# Altium schematic sheet DCDC_Slow.SchDoc
size 594 x 420 mm; Address1: Address1; Address2: Address2; Address3: Address3; Address4: Address4; SheetNumber: 1; Scale: 1:1; Разраб.: Иванов; Обозначение документа: АБВГ.123456.001 Э3; Пров.: Петров; Утв.: Сидоров; Наименование организации: ОАО "Концерн "МПО-Гидроприбор"; Перв. применение: АБВГ.123456.000; Наименование изделия 1: Плата; Наименование изделия 2: Схема электрическая; Наименование изделия 3: принципиальная; Нач. отд.: Нач. отд.; Фамилия нач. отд.: Сидоров
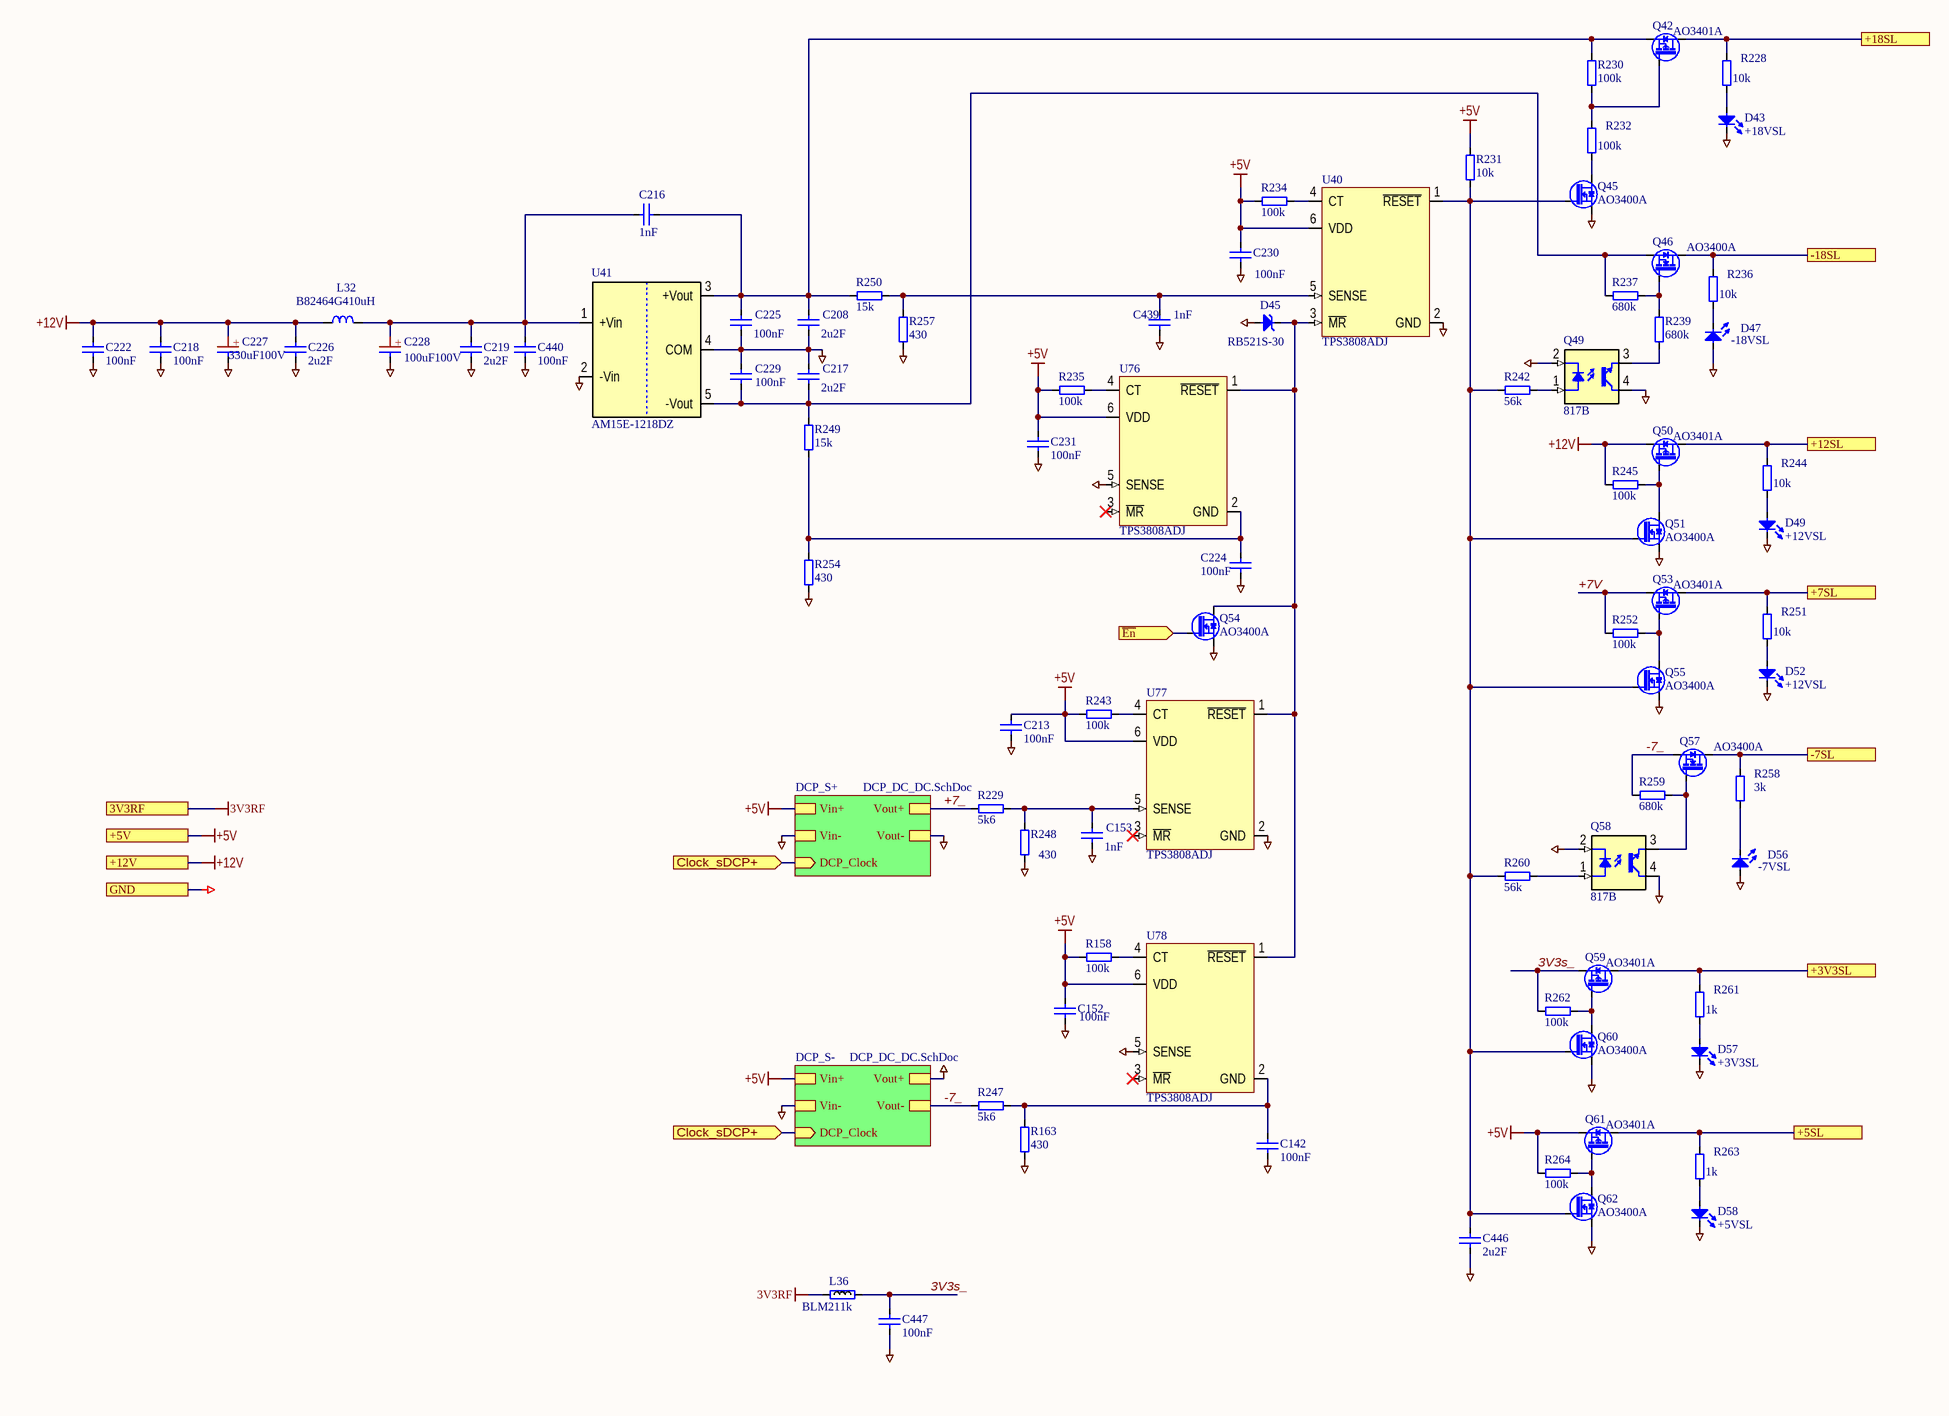
[diagram p0: DCDC_Slow.SchDoc]

## Parts
C142  100nF  [SMD0805CAP]
C152  100nF  [SMD0805CAP]
C153  1nF  [SMD0805CAP]
C208  2u2F  [SMD0805CAP]
C213  100nF  [SMD0805CAP]
C216  1nF  [SMD0805CAP]
C217  2u2F  [SMD0805CAP]
C218  100nF  [SMD0805CAP]
C219  2u2F  [SMD0805CAP]
C222  100nF  [SMD0805CAP]
C224  100nF  [SMD0805CAP]
C225  100nF  [SMD0805CAP]
C226  2u2F  [SMD0805CAP]
C227  330uF100V  [CAPPR750-1600X2000]
C228  100uF100V  [CAPPR500-1000X1250]
C229  100nF  [SMD0805CAP]
C230  100nF  [SMD0805CAP]
C231  100nF  [SMD0805CAP]
C439  1nF  [SMD0805CAP]
C440  100nF  [SMD0805CAP]
C446  2u2F  [SMD0805CAP]
C447  100nF  [SMD0805CAP]
D43  +18VSL  [LED0603]
D45  RB521S-30  [SODFL1608X65N]
D47  -18VSL  [LED0603]
D49  +12VSL  [LED0603]
D52  +12VSL  [LED0603]
D56  -7VSL  [LED0603]
D57  +3V3SL  [LED0603]
D58  +5VSL  [LED0603]
L32  B82464G410uH  [IND_COILCRAFT_MSS1038]
L36  BLM211k  [RESC2012X50N]
Q42  AO3401A  [SOT95P229X119-3N]
Q45  AO3400A  [SOT95P229X119-3N]
Q46  AO3400A  [SOT95P229X119-3N]
Q49  817B  [DIP4-300]
Q50  AO3401A  [SOT95P229X119-3N]
Q51  AO3400A  [SOT95P229X119-3N]
Q53  AO3401A  [SOT95P229X119-3N]
Q54  AO3400A  [SOT95P229X119-3N]
Q55  AO3400A  [SOT95P229X119-3N]
Q57  AO3400A  [SOT95P229X119-3N]
Q58  817B  [DIP4-300]
Q59  AO3401A  [SOT95P229X119-3N]
Q60  AO3400A  [SOT95P229X119-3N]
Q61  AO3401A  [SOT95P229X119-3N]
Q62  AO3400A  [SOT95P229X119-3N]
R158  100k  [SMD0805RES]
R163  430  [SMD0805RES]
R228  10k  [SMD0805RES]
R229  5k6  [SMD0805RES]
R230  100k  [SMD0805RES]
R231  10k  [SMD0805RES]
R232  100k  [SMD0805RES]
R234  100k  [SMD0805RES]
R235  100k  [SMD0805RES]
R236  10k  [SMD0805RES]
R237  680k  [SMD0805RES]
R239  680k  [SMD0805RES]
R242  56k  [SMD0805RES]
R243  100k  [SMD0805RES]
R244  10k  [SMD0805RES]
R245  100k  [SMD0805RES]
R247  5k6  [SMD0805RES]
R248  430  [SMD0805RES]
R249  15k  [SMD0805RES]
R250  15k  [SMD0805RES]
R251  10k  [SMD0805RES]
R252  100k  [SMD0805RES]
R254  430  [SMD0805RES]
R257  430  [SMD0805RES]
R258  3k  [SMD0805RES]
R259  680k  [SMD0805RES]
R260  56k  [SMD0805RES]
R261  1k  [SMD0805RES]
R262  100k  [SMD0805RES]
R263  1k  [SMD0805RES]
R264  100k  [SMD0805RES]
U40  TPS3808ADJ  [SOT95P270X145-6N]
U41  AM15E-1218DZ  [AM15E]
U76  TPS3808ADJ  [SOT95P270X145-6N]
U77  TPS3808ADJ  [SOT95P270X145-6N]
U78  TPS3808ADJ  [SOT95P270X145-6N]

## Sub-sheets
DCP_S+ = DCP_DC_DC.SchDoc: DCP_Clock (in), Vout+, Vout-, Vin-, Vin+
DCP_S- = DCP_DC_DC.SchDoc: DCP_Clock (in), Vout+, Vout-, Vin-, Vin+

## Ports
3V3RF, +3V3SL, +5SL, +5V, +7SL, +12SL, +12V, +18SL, -7SL, -18SL, Clock_sDCP+ (in), GND, ~{En} (in)

## Nets
3V3RF: L36.2 ; port 3V3RF
+5V: C152.2 C213.2 C230.2 C231.2 Q61.2(S) R158.1 R231.1 R234.1 R235.1 R243.1 R264.2 U40.6(VDD) U76.6(VDD) U77.6(VDD) U78.6(VDD) ; port +5V, sheet DCP_S+/Vin+, sheet DCP_S-/Vin+
+12V: C218.2 C222.2 C226.2 C227.1(+) L32.1 Q50.2(S) R245.2 ; port +12V
GND: C142.2 C152.1 C153.1 C208.1 C213.1 C217.2 C218.1 C219.1 C222.1 C224.2 C225.2 C226.1 C227.2 C228.2 C229.1 C230.1 C231.1 C439.1 C440.2 C446.2 C447.1 D43.1(C) D45.2(A) D47.2(A) D49.1(C) D52.1(C) D56.2(A) D57.1(C) D58.1(C) Q45.2(S) Q49.2(C) Q49.4(C) Q51.2(S) Q54.2(S) Q55.2(S) Q58.2(C) Q58.4(C) Q60.2(S) Q62.2(S) R163.1 R248.2 R254.1 R257.1 U40.2(GND) U41.2(-Vin) U41.4(COM) U76.5(SENSE) U77.2(GND) U78.5(SENSE) ; port GND, sheet DCP_S+/Vout-, sheet DCP_S+/Vin-, sheet DCP_S-/Vout+, sheet DCP_S-/Vin-
3V3s_: C447.2 L36.1 Q59.2(S) R262.2
+3V3SL: Q59.3(D) R261.2 ; port +3V3SL
+5SL: Q61.3(D) R263.2 ; port +5SL
+7_: R229.2 ; sheet DCP_S+/Vout+
+7SL: Q53.3(D) R251.2 ; port +7SL
+7V: Q53.2(S) R252.2
+12SL: Q50.3(D) R244.2 ; port +12SL
+18SL: Q42.3(D) R228.2 ; port +18SL
-7_: Q57.2(S) R247.1 R259.2 ; sheet DCP_S-/Vout-
-7SL: Q57.3(D) R258.2 ; port -7SL
-18SL: Q46.3(D) R236.2 ; port -18SL
~{En}: Q54.1(G) ; port ~{En}
Clock_sDCP+: port Clock_sDCP+, sheet DCP_S+/DCP_Clock, sheet DCP_S-/DCP_Clock
NetC142_1: C142.1 R163.2 R247.2 U78.2(GND)
NetC153_2: C153.2 R229.1 R248.1 U77.5(SENSE)
NetC208_2: C208.2 C216.2 C225.1 Q42.2(S) R230.1 R250.2 U41.3(+Vout)
NetC216_1: C216.1 C219.2 C228.1(+) C440.1 L32.2 U41.1(+Vin)
NetC217_1: C217.1 C229.2 Q46.2(S) R237.2 R249.1 U41.5(-Vout)
NetC224_1: C224.1 R249.2 R254.2 U76.2(GND)
NetC439_2: C439.2 R250.1 R257.2 U40.5(SENSE)
NetC446_1: C446.1 Q45.1(G) Q51.1(G) Q55.1(G) Q60.1(G) Q62.1(G) R231.2 R242.1 R260.1 U40.1(~{RESET})
NetD43_2: D43.2(A) R228.1
NetD45_1: D45.1(C) Q54.3(D) U40.3(~{MR}) U76.1(~{RESET}) U77.1(~{RESET}) U78.1(~{RESET})
NetD47_1: D47.1(C) R236.1
NetD49_2: D49.2(A) R244.1
NetD52_2: D52.2(A) R251.1
NetD56_1: D56.1(C) R258.1
NetD57_2: D57.2(A) R261.1
NetD58_2: D58.2(A) R263.1
NetQ42_1: Q42.1(G) R230.2 R232.2
NetQ45_3: Q45.3(D) R232.1
NetQ46_1: Q46.1(G) R237.1 R239.2
NetQ49_1: Q49.1(A) R242.2
NetQ49_3: Q49.3(E) R239.1
NetQ50_1: Q50.1(G) Q51.3(D) R245.1
NetQ53_1: Q53.1(G) Q55.3(D) R252.1
NetQ57_1: Q57.1(G) Q58.3(E) R259.1
NetQ58_1: Q58.1(A) R260.2
NetQ59_1: Q59.1(G) Q60.3(D) R262.1
NetQ61_1: Q61.1(G) Q62.3(D) R264.1
NetR158_2: R158.2 U78.4(CT)
NetR234_2: R234.2 U40.4(CT)
NetR235_2: R235.2 U76.4(CT)
NetR243_2: R243.2 U77.4(CT)

Not connected (* = marked no-connect by the designer): U76 3(~{MR})*; U77 3(~{MR})*; U78 3(~{MR})*

## Notes on the sheet
- Подп. и дата
- Инв. № дубл.
- Взам. инв. №
- Инв. № подл.
- Изм.
- Лист
- № докум.
- Подп.
- Дата
- Копировал
- Формат А2

## Library data of the parts
C142 C152 C153 C208 C213 C216-C219 C222 C224-C226 C229-C231 C439 C440 C446 C447 = C0805: Чип конденсатор 0805; Voltage: 25V; Vendor: Vishay; DielectricType: X5R; SMD Solders: 2; Solder Option: RM; Tolerance: 20%; Pkg: SMD0805; Device: Cap0805; Price: 2
  C142 C152 C213 C218 C222 C224 C225 C229-C231 C440 C447: Value: 100nF
  C153 C216 C439: Value: 1nF
  C208 C217 C219 C226 C446: Value: 2u2F
C227 = CAP_POL_7_5x16: Конденсатор полярный d16 p7.5мм; Voltage: 100V; Vendor: Vishay; Value: 330uF; SMD Solders: 0; Solder Option: RM; Tolerance: 20%; Pkg: 7.5x16mm; Device: Cap+; THD Solders: 2; Price: 30
C228 = CAP_POL_5x10: Конденсатор полярный d10 p5мм; Voltage: 100V; Vendor: Vishay; Value: 100uF; SMD Solders: 0; Solder Option: RM; Tolerance: 20%; Pkg: 5x10mm; Device: Cap+; THD Solders: 2; Price: 20
D43 D47 D49 D52 D56-D58 = LED0603: Чип светодиод 0603; Vendor: KB; SMD Solders: 2; Solder Option: RM; Pkg: SMD0603; Price: 10; Device: LED0603
  D43: Value: +18VSL
  D47: Value: -18VSL
  D49 D52: Value: +12VSL
  D56: Value: -7VSL
  D57: Value: +3V3SL
  D58: Value: +5VSL
D45 = RB521S-30: Чип Шоттки диод; Vendor: CTK; Voltage: 30V; SMD Solders: 2; Solder Option: RM; Pkg: SOD523; Price: 5; Device: RB521S-30; Name to order: RB521S-30
L32 = B82464G4: SMD Дроссель; Vendor: Epcos; Value: 10uH; Voltage: 2; Solder Option: RM; Tolerance: 20%; Pkg: SMD10.4x10.4mm; THD Solders: 0; Name to order: B82464G4103M; Current: 3A5; Price: 400; SMD Solders: 2; Device: B82464G4
L36 = BLM21: SMD Ferrite bead 0805; Vendor: Vishay; Value: 1k; Pkg: SMD0805; SMD Solders: 2; Solder Option: RM; Price: 10; Device: BLM21
Q42 Q50 Q53 Q59 Q61 = AO3401A: PMOS; Vendor: UMW; Pkg: SOT23; SMD Solders: 3; Solder Option: RM; THD Solders: 0; Voltage: -30V; Price: 10; Device: AO3401A; Name to order: AO3401A
Q45 Q46 Q51 Q54 Q55 Q57 Q60 Q62 = AO3400A: NMOS; Vendor: UMW; Pkg: SOT23; SMD Solders: 3; Solder Option: RM; Voltage: 30V; Price: 10; Device: AO3400A; Name to order: AO3400A
Q49 Q58 = 817B: Optotransistor; Pkg: DIP4; SMD Solders: 0; Solder Option: RM; THD Solders: 4; Vendor: UMW; Voltage: 35V; Device: 817B; Price: 10; Name to order: 817B; Current: 0
R158 R163 R228-R232 R234-R237 R239 R242-R245 R247-R252 R254 R257-R264 = R0805: Чип резистор 0805; Vendor: Vishay; SMD Solders: 2; Solder Option: RM; TC: 100ppm/C; Tolerance: 1%; Pkg: SMD0805; Pwr: 125mW; Device: Res0805; Price: 2
  R158 R230 R232 R234 R235 R243 R245 R252 R262 R264: Value: 100k
  R163 R248 R254 R257: Value: 430
  R228 R231 R236 R244 R251: Value: 10k
  R229 R247: Value: 5k6
  R237 R239 R259: Value: 680k
  R242 R260: Value: 56k
  R249 R250: Value: 15k
  R258: Value: 3k
  R261 R263: Value: 1k
U40 U76-U78 = TPS3808: Supervisory Circuit. Low-Quiescent-Current, Programmable-Delay; Vendor: Texas Instruments; Value: ADJ; Pkg: SOT23-6; SMD Solders: 6; Solder Option: RM; THD Solders: 0; Name to order: TPS3808G01DBV; Current: 6uA; thVoltage: 400mV; Price: 200; Device: TPS3808
U41 = AM15E-: Negative LDO Linear stabilizer; Vendor: Aimtec; Value: 1218DZ; Pkg: DCDC_5; SMD Solders: 0; Solder Option: RM; THD Solders: 5; Name to order: AM15-1218DZ; Price: 2000; Device: AM15E-